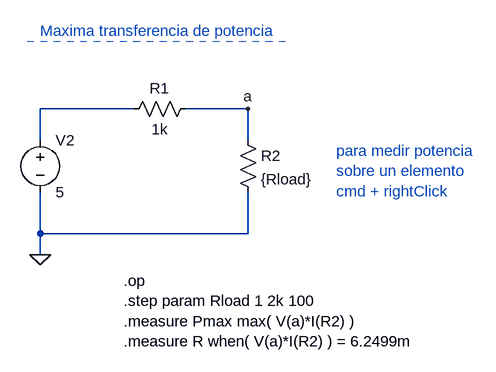
[diagram p0: schematic MaxTPot.asc]
MaxTPot.asc, the LTspice schematic file:
Version 4
SHEET 1 896 680
WIRE 368 224 224 224
WIRE 544 224 448 224
WIRE 224 272 224 224
WIRE 544 272 544 224
WIRE 224 416 224 352
WIRE 544 416 544 352
WIRE 544 416 224 416
WIRE 224 448 224 416
FLAG 224 448 0
FLAG 544 224 a
SYMBOL Voltage 224 256 R0
SYMATTR InstName V2
SYMATTR Value 5
SYMBOL Res 352 240 R270
WINDOW 0 32 56 VTop 2
WINDOW 3 0 56 VBottom 2
SYMATTR InstName R1
SYMATTR Value 1k
SYMBOL Res 528 256 R0
SYMATTR InstName R2
SYMATTR Value {Rload}
TEXT 352 488 Left 2 !.op\n.step param Rload 1 2k 100\n.measure Pmax max( V(a)*I(R2) )\n.measure R when( V(a)*I(R2) ) = 6.2499m
TEXT 224 104 Left 2 ;Maxima transferencia de potencia
TEXT 680 288 Left 2 ;para medir potencia\nsobre un elemento\ncmd + rightClick
LINE Normal 204 120 612 120 2

The netlist it stands for:
* MaxTPot.asc
V2 N001 0 5
R1 N001 a 1k
R2 a 0 {Rload}
.op
.step param Rload 1 2k 100
.measure Pmax max( V(a)*I(R2) )
.measure R when( V(a)*I(R2) ) = 6.2499m
* Maxima transferencia de potencia
* para medir potencia
* sobre un elemento
* cmd + rightClick
.backanno
.end